# EAGLE design controller_board (EAGLE 7.2.0)
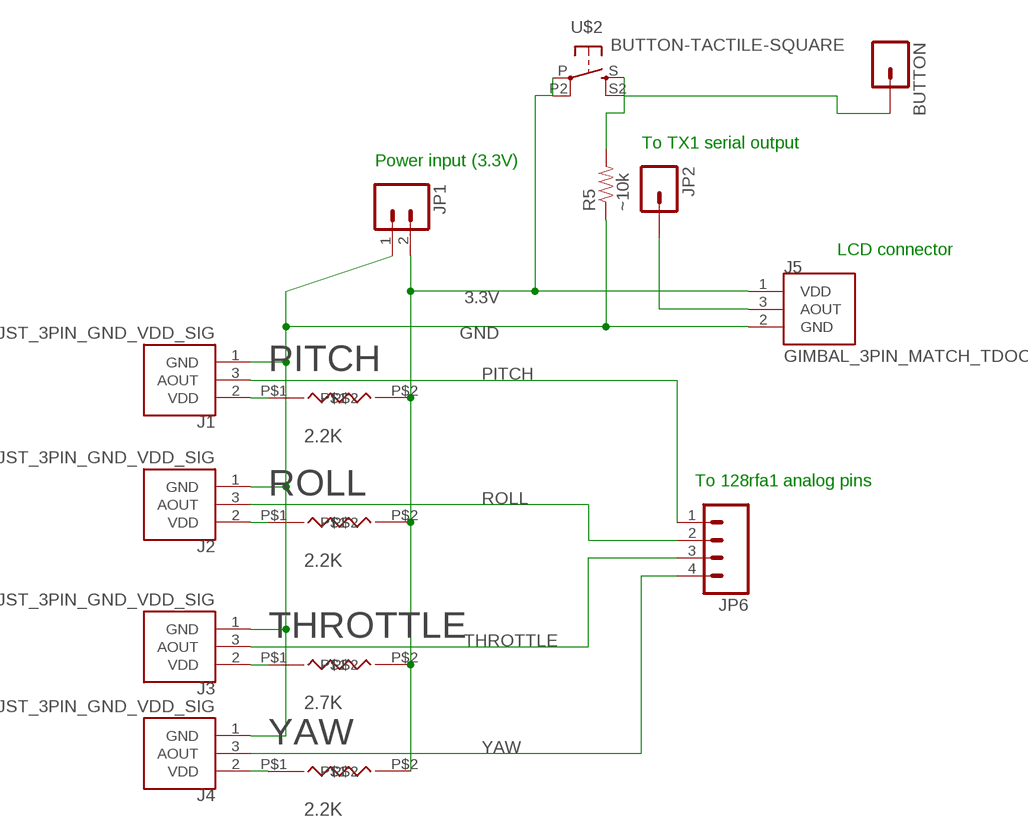
[diagram p0: schematic, sheet 1]

## Parts
BUTTON  M01PTH  [1X01]
J1  JST_3PIN_GND_VDD_SIG  [JST-3-PTH-REVERSE]
J2  JST_3PIN_GND_VDD_SIG  [JST-3-PTH-REVERSE]
J3  JST_3PIN_GND_VDD_SIG  [JST-3-PTH-REVERSE]
J4  JST_3PIN_GND_VDD_SIG  [JST-3-PTH-REVERSE]
J5  GIMBAL_3PIN_MATCH_TDOCU  [JST-3-PTH]
JP1  M021X02_NO_SILK  [1X02_NO_SILK]
JP2  M01PTH  [1X01]
JP6  M04PTH  [1X04]
PITCH  2.2K  RESISTOR_THROUGH_HOLE  [RESISTOR_THROUGH_HOLE]
R5  ~10k  RESISTORPTH-1/4W  [AXIAL-0.4]
ROLL  2.2K  RESISTOR_THROUGH_HOLE  [RESISTOR_THROUGH_HOLE]
THROTTLE  2.7K  RESISTOR_THROUGH_HOLE  [RESISTOR_THROUGH_HOLE]
U$2  BUTTON-TACTILE-SQUARE  [BUTTON-TACTILE-SQUARE-ADAFRUIT1010]
YAW  2.2K  RESISTOR_THROUGH_HOLE  [RESISTOR_THROUGH_HOLE]

## Nets
3.3V: J5.1(VDD) JP1.2 PITCH.P$2 ROLL.P$2 THROTTLE.P$2 U$2.P U$2.P2(P1) YAW.P$2
GND: J1.1(GND) J2.1(GND) J3.1(GND) J4.1(GND) J5.2(GND) JP1.1 R5.P$1
N$1: J1.2(VDD) PITCH.P$1
N$2: J2.2(VDD) ROLL.P$1
N$3: J3.2(VDD) THROTTLE.P$1
N$4: J4.2(VDD) YAW.P$1
N$6: BUTTON.1 R5.P$2 U$2.S U$2.S2(S1)
N$9: J5.3(AOUT) JP2.1
PITCH: J1.3(AOUT) JP6.1
ROLL: J2.3(AOUT) JP6.2
THROTTLE: J3.3(AOUT) JP6.3
YAW: J4.3(AOUT) JP6.4

## Notes on the sheet
- To TX1 serial output
- Power input (3.3V)
- LCD connector
- To 128rfa1 analog pins

## Library data of the parts
BUTTON JP2 = SparkFun-Connectors:M01: Header 1 Standard 1-pin 0.1" header. Use with straight break away headers (SKU : PRT-00116), right angle break away headers (PRT-00553), swiss pins (PRT-00743), machine pins (PRT-00117), and female headers (PRT-00115).
J1-J4 = Controller:JST_3PIN_GND_VDD_SIG
J5 = Controller:GIMBAL_3PIN_MATCH_TDOCU
JP1 = SparkFun-Connectors:M02: Standard 2-pin 0.1" header. Use with - straight break away headers ( PRT-00116) - right angle break away headers (PRT-00553) - swiss pins (PRT-00743) - machine pins (PRT-00117) - female headers (PRT-00115) Molex polarized connector foot print use with: PRT-08233 with associated crimp pins and housings. 2.54_SCREWTERM for use with PRT-10571. 3.5mm Screw Terminal footprints for PRT-08084 5mm Screw Terminal footprints for use with PRT-08432
JP6 = SparkFun-Connectors:M04: Header 4 Standard 4-pin 0.1" header. Use with straight break away headers (SKU : PRT-00116), right angle break away headers (PRT-00553), swiss pins (PRT-00743), machine pins (PRT-00117), and female headers (PRT-00115). Molex polarized connector foot print use with SKU : PRT-08231 with associated crimp pins and housings. 1MM SMD Version SKU: PRT-10208
PITCH ROLL THROTTLE YAW = Kirt-Lab4:RESISTOR_THROUGH_HOLE: The through-hole resistor for the remote control board Datasheet: Labs/Lab4/datasheets/CRF12_Resistor.pdf Size: 1/6W; style: CFr-12; CREATOR: Kirt Spotkaeff; DIST: Digikey
R5 = SparkFun-Resistors:RESISTOR: Resistor Basic schematic elements and footprints for 0603, 1206, and PTH resistors.
U$2 = Controller:BUTTON-TACTILE

## Board
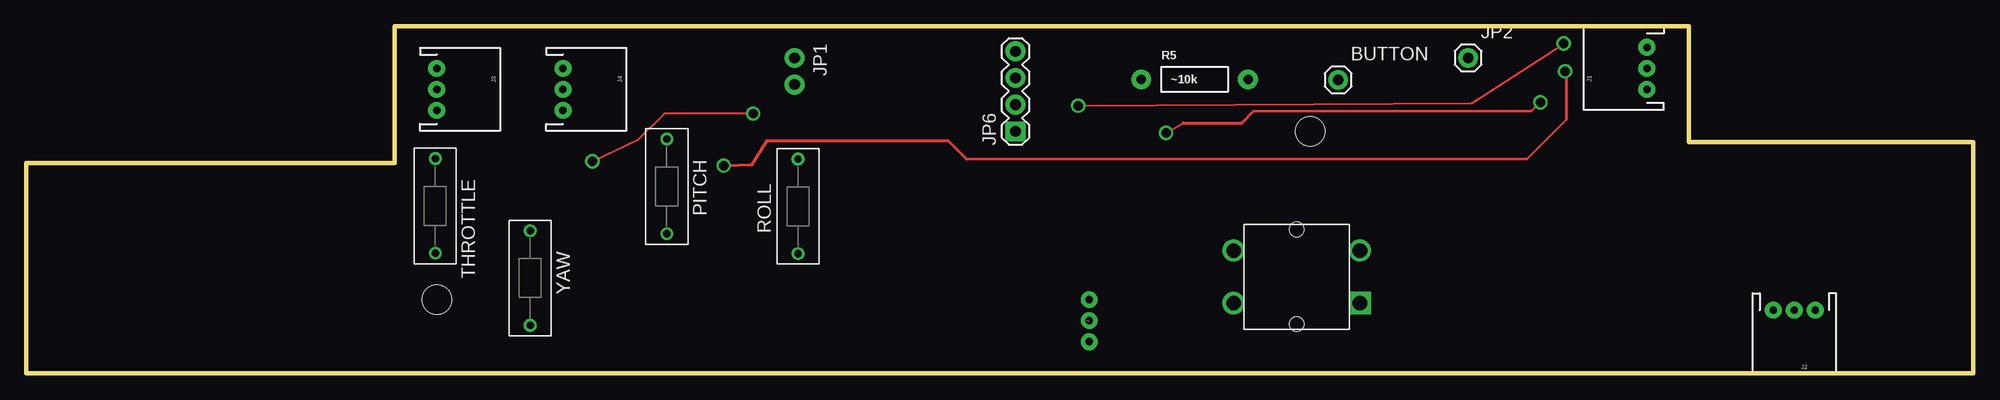
[diagram p1: board, top side]
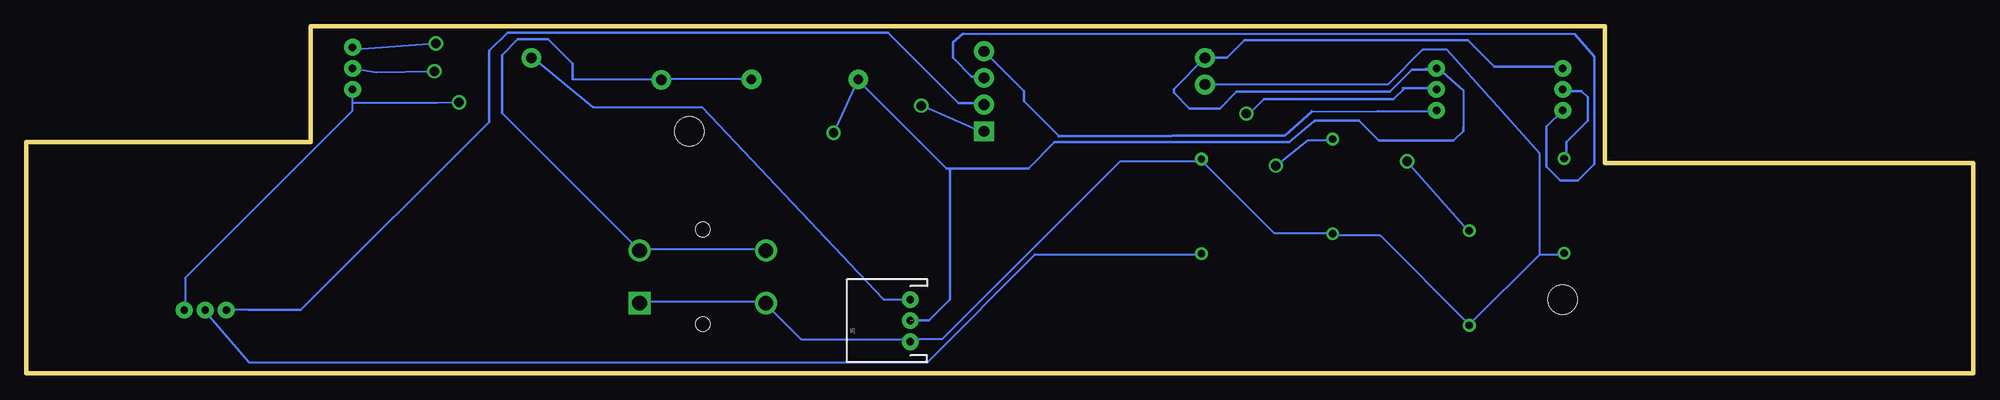
[diagram p2: board, bottom side, seen from below]

Size 185 x 33 mm. Coordinates in mm from the lower left corner, seen from the top.
Outline: 158,22 158,33 35,33 35,20 0,20 0,0 185,0 185,22 158,22
Copper layers (1*16): Top 0.035559375mm / dielectric 1.501140625mm / Bottom 0.035559375mm
Design rules "4pcb-33board *": minimum track width 0.2mm, minimum drill 0.6mm, track to track 12mil, track to pad 12mil, pad to pad 12mil, via to via 12mil, smd to smd 12mil, copper to edge 10mil, drill to drill 10mil, minimum pad ring 10mil, minimum via ring 8mil, stop-mask expansion 4mil, vias tented up to drill 0mil, thermal gap 10mil
tRestrict: area 38,23.6 to 40.3,30.2; area 49.9,23.9 to 52,30.1; area 71.2,25.9 to 74.7,31.5; area 92.2,21 to 96.1,32.4; area 104.5,26.6 to 107.6,29.2; area 114.6,26.6 to 117.6,29.2; area 123.4,25.9 to 126.7,30.1; area 135.1,28 to 139.5,32; area 153.1,24.8 to 155.6,32.7; area 164.3,4.6 to 172.2,7.5; area 112.4,3.9 to 116.2,14.3; area 124.6,4.3 to 129,13.9; 10 more areas
vRestrict: area 36.8,10.3 to 41.1,21.3; area 46.2,3.4 to 49.5,14.5; area 58.9,12 to 62.7,23.4; area 71.4,10.4 to 74.9,21.2; area 92.2,21.3 to 95.7,31.8; area 99.8,1.5 to 106.8,9; area 113.2,2 to 128.5,16.4; area 104.5,26.6 to 118,29.2; area 122.9,25.7 to 139.5,32.2; area 148.6,24.8 to 155.2,32.7; area 164,0.3 to 171.9,7.6; area 40.7,23.1 to 44.9,30.9; 1 more areas

### Footprints (pad centres in the part's own frame; a part is rotated, then mirrored left to right if it is on the bottom)
1X01 = drill 1.016 pad 1.88: 1 0,0
JST-3-PTH-REVERSE = drill 0.7 pad 1.6: 1 -2,0; 2 0,0; 3 2,0
JST-3-PTH = drill 0.7 pad 1.6: 1 -2,0; 2 0,0; 3 2,0
1X02_NO_SILK = drill 1.016 pad 1.88: 1 0,0; 2 2.54,0
1X04 = drill 1.016 pad 1.88 square: 1 0,0 | drill 1.016 pad 1.88: 2 2.54,0; 3 5.08,0; 4 7.62,0
RESISTOR_THROUGH_HOLE = drill 0.7: P$1 -4.5,0; P$2 4.5,0
AXIAL-0.4 = drill 0.9 pad 1.88: P$1 -5.08,0; P$2 5.08,0
CONNECTOR_BOARD_OUTLINE = hole 2.8: 154,45; 71,29
BUTTON-TACTILE-SQUARE-ADAFRUIT1010 = drill 1.4 square: P -6,2.5 | drill 1.4: P2 6,2.5; S -6,-2.5; S2 6,-2.5 | hole 1.4: 0,-4.5; 0,4.5

### Placement (x,y rotation side)
BUTTON  124.66,27.9 0 top
J1  154,29 90 top
J2  168,6 180 top
J3  39,27 270 top
J4  51,27 270 top
J5  101,5 90 bottom
JP1  73,30 270 top
JP2  137,30 0 top
JP6  94,23 90 top
PITCH  60.86,17.77 270 top
R5  111.01,27.94 0 top
ROLL  73.33,15.87 90 top
THROTTLE  38.86,15.92 270 top
U$1  [CONNECTOR_BOARD_OUTLINE]  -32,-22 0 top
U$2  120.72,9.17 180 top
YAW  47.88,9.05 270 top

### Tracks (layer width: path | path; a pad name or v marks a point on that pad's centre or on a via)
3.3V
  Bottom 0.2: U$2.P 126.51,6.77 114.9,6.77 U$2.P2 114.64,6.52 111.36,3.24 101.01,3.24 J5.1 100.76,3.24 97.99,3.24 81.08,20.15 73.5,20.15 ROLL.P$2 73.25,20.15 66.44,13.34 60.88,13.34 PITCH.P$2 60.63,13.08 56.34,13.08 48.01,4.75 YAW.P$2 47.76,4.75 41.2,11.32 | 41.2,11.32 38.92,11.32 THROTTLE.P$2 | 41.2,11.32 41.2,20.91 50.01,30.77 52.33,30.77 55.63,27.47 JP1.2
GND  (via drill 0.9)  (1 unrouted)
  Top 0.2: v108.29,22.86 109.94,23.81
  Top 0.254: 116.62,24.92 143.04,24.92 v143.87,25.76
  Top 0.305: 109.94,23.81 115.5,23.81 116.62,24.92
  Bottom 0.2: 154.02,25.7 154.02,26.97 J1.1 | 154.02,25.7 154.02,24.95 169.92,9.05 169.92,6.02 J2.1 | 100.76,5.51 100.76,5.01 | 99.75,21.66 100.11,22.02 105.81,27.72 R5.P$1 106.06,27.72 v108.29,22.86 | 72.49,30.75 73,30.25 JP1.1 73.25,29.99 | 39.18,29.24 J3.1 | 52.05,28.98 51.04,28.98 J4.1 50.79,28.98 48.47,26.92 48.47,23.39 | 62.63,23.95 64.96,21.96 | 154.02,25.7 145.94,25.7 v143.87,25.76
  Bottom 0.254: 48.47,23.39 48.47,23.04 49.39,22.12 56.47,22.12 58.39,24.05 62.53,24.05 62.63,23.95 | J4.1 51.13,28.87 53.32,28.87 55.43,26.77 70.02,26.77 71.59,25.19 74.47,25.19 75.97,26.68 75.97,27.03 JP1.1 70.93,30 69.26,31.67 48.02,31.67 45.48,29.14 39.14,29.14 J3.1 | 64.96,21.96 87.3,21.96 89.78,19.49 97.21,19.49 | 100.76,5.01 99.23,5.01 97.21,7.03 97.21,19.49 | 97.21,19.49 97.57,19.49 100.11,22.02
N$1  (via drill 0.9)
  Top 0.254: 89.34,20.36 142.57,20.36 146.34,24.13 146.34,28.6 v146.22,28.72
  Top 0.305: v66.27,19.75 68.97,19.83 70.37,22.12 87.59,22.12 89.34,20.36
  Bottom 0.2: v66.27,19.75 63.24,22.17 60.88,22.17 PITCH.P$1 | v146.22,28.72 151.75,28.63 153.77,28.98 J1.2
N$2
  Bottom 0.2: ROLL.P$1 73.5,11.32 89.15,11.32 99.35,1.02 163.86,1.02 167.9,5.76 J2.2
N$3
  Bottom 0.2: 38.67,20.66 THROTTLE.P$1 | 38.92,26.97 J3.2
  Bottom 0.254: 38.67,20.66 38.67,22 36.63,24.05 36.63,26.24 37.24,26.85 38.85,26.85 J3.2
N$4  (via drill 0.9)
  Top 0.2: v53.79,20.15 58.11,22.17 60.63,24.69 v69.07,24.69
  Bottom 0.2: v53.79,20.15 48.01,13.59 YAW.P$1
  Bottom 0.254: v69.07,24.69 68.77,24.69 67.4,26.06 55.08,26.06 54.02,27.12 | 54.02,27.12 54.2,27.12 | 54.02,27.12 51.12,27.12 J4.2
N$6
  Bottom 0.2: R5.P$2 116.16,27.98 124.49,27.98 BUTTON.1 124.74,27.98 133.07,27.98 | U$2.S2 114.9,11.82 126.51,11.82 U$2.S 126.76,11.82
  Bottom 0.254: 133.07,27.98 133.07,29.42 135.41,31.77 138.29,31.77 139.78,30.27 139.78,24.73 U$2.S
N$9
  Bottom 0.2: J5.3 101.01,7.03 103.54,7.03 120.79,25.32 131.14,25.32 136.86,29.99 JP2.1
PITCH  (via drill 0.9)
  Top 0.2: v146.08,31.37 137.36,25.7 v99.95,25.44
  Bottom 0.2: v146.08,31.37 153.77,30.75 J1.3 | v99.95,25.44 94.2,22.93 JP6.1
ROLL
  Bottom 0.2: 163.86,6.02 165.88,6.02 J2.3 | 94.2,25.7 JP6.2
  Bottom 0.254: 94.2,25.7 96.42,25.7 103.12,32.41 139.27,32.41 141.02,30.66 141.02,23.91 158.91,6.02 163.86,6.02
THROTTLE
  Bottom 0.2: 39.18,24.95 J3.3 | 94.2,28.23 JP6.3
  Bottom 0.254: J3.3 40.56,23.44 40.56,19.66 39.25,18.35 37.59,18.35 36.01,19.92 36.01,30.11 37.85,32.25 95.98,32.29 96.95,31.5 96.95,30.01 95.17,28.23 94.2,28.23
YAW
  Bottom 0.2: 62.86,24.89 56.59,24.95 51.04,24.95 J4.3 | 93.95,30.5 JP6.4
  Bottom 0.254: 86.88,22.55 90.22,25.89 90.22,26.84 JP6.4
  Bottom 0.305: 86.88,22.55 65.36,22.64 62.86,24.89

### Text on the board
tCopperArt: Kirt Spotkaeff